# Altium project Commutation.Board.PrjPcb
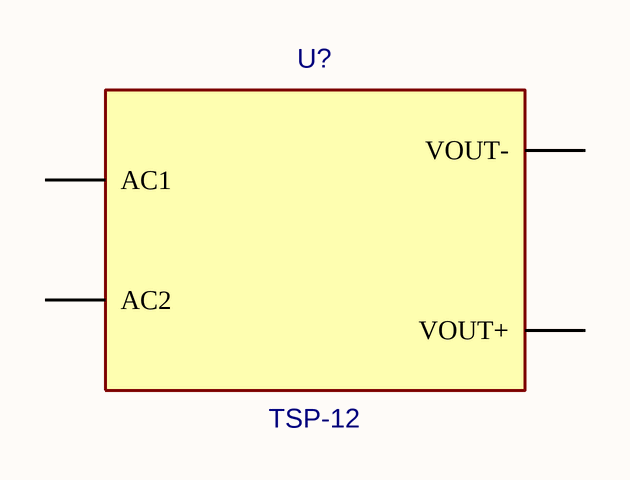
[diagram p0: Commutation.Board.SchDoc]
1 sheet, 1 parts. Net scope: global (net labels, ports and power ports of the same name join across sheets).
Board file: Commutation.Board.PcbDoc

## Sheet Commutation.Board.SchDoc
size A4

### Parts
U?  TSP-12  [TSP-12]

### Nets

Not connected (* = marked no-connect by the designer): U? P$1(AC1) P$2(AC2) P$3(VOUT-) P$4(VOUT+)